# Altium schematic sheet RightInterface.SchDoc
size A4
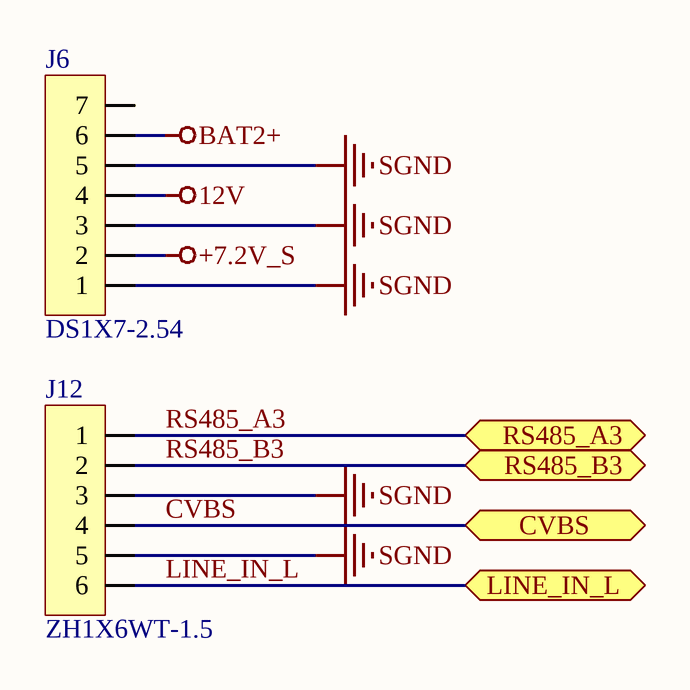
[diagram p0: RightInterface.SchDoc]

## Parts
J6  DS1X7-2.54  [DS1X7H-2.54]
J12  ZH1X6WT-1.5  [ZH1X6WT-1.5]

## Ports
CVBS (bidir), LINE_IN_L (bidir), RS485_A3 (bidir), RS485_B3 (bidir)

## Nets
12V: J6.4
+7.2V_S: J6.2
BAT2+: J6.6
SGND: J6.1 J6.3 J6.5 J12.3 J12.5
CVBS: J12.4 ; port CVBS
LINE_IN_L: J12.6 ; port LINE_IN_L
RS485_A3: J12.1 ; port RS485_A3
RS485_B3: J12.2 ; port RS485_B3

Not connected (* = marked no-connect by the designer): J6 7

## Library data of the parts
J6 = HEADER1X7
J12 = HEADER1X6